# EAGLE design DRM-X_voice(split resistors) (EAGLE 7.4.0)
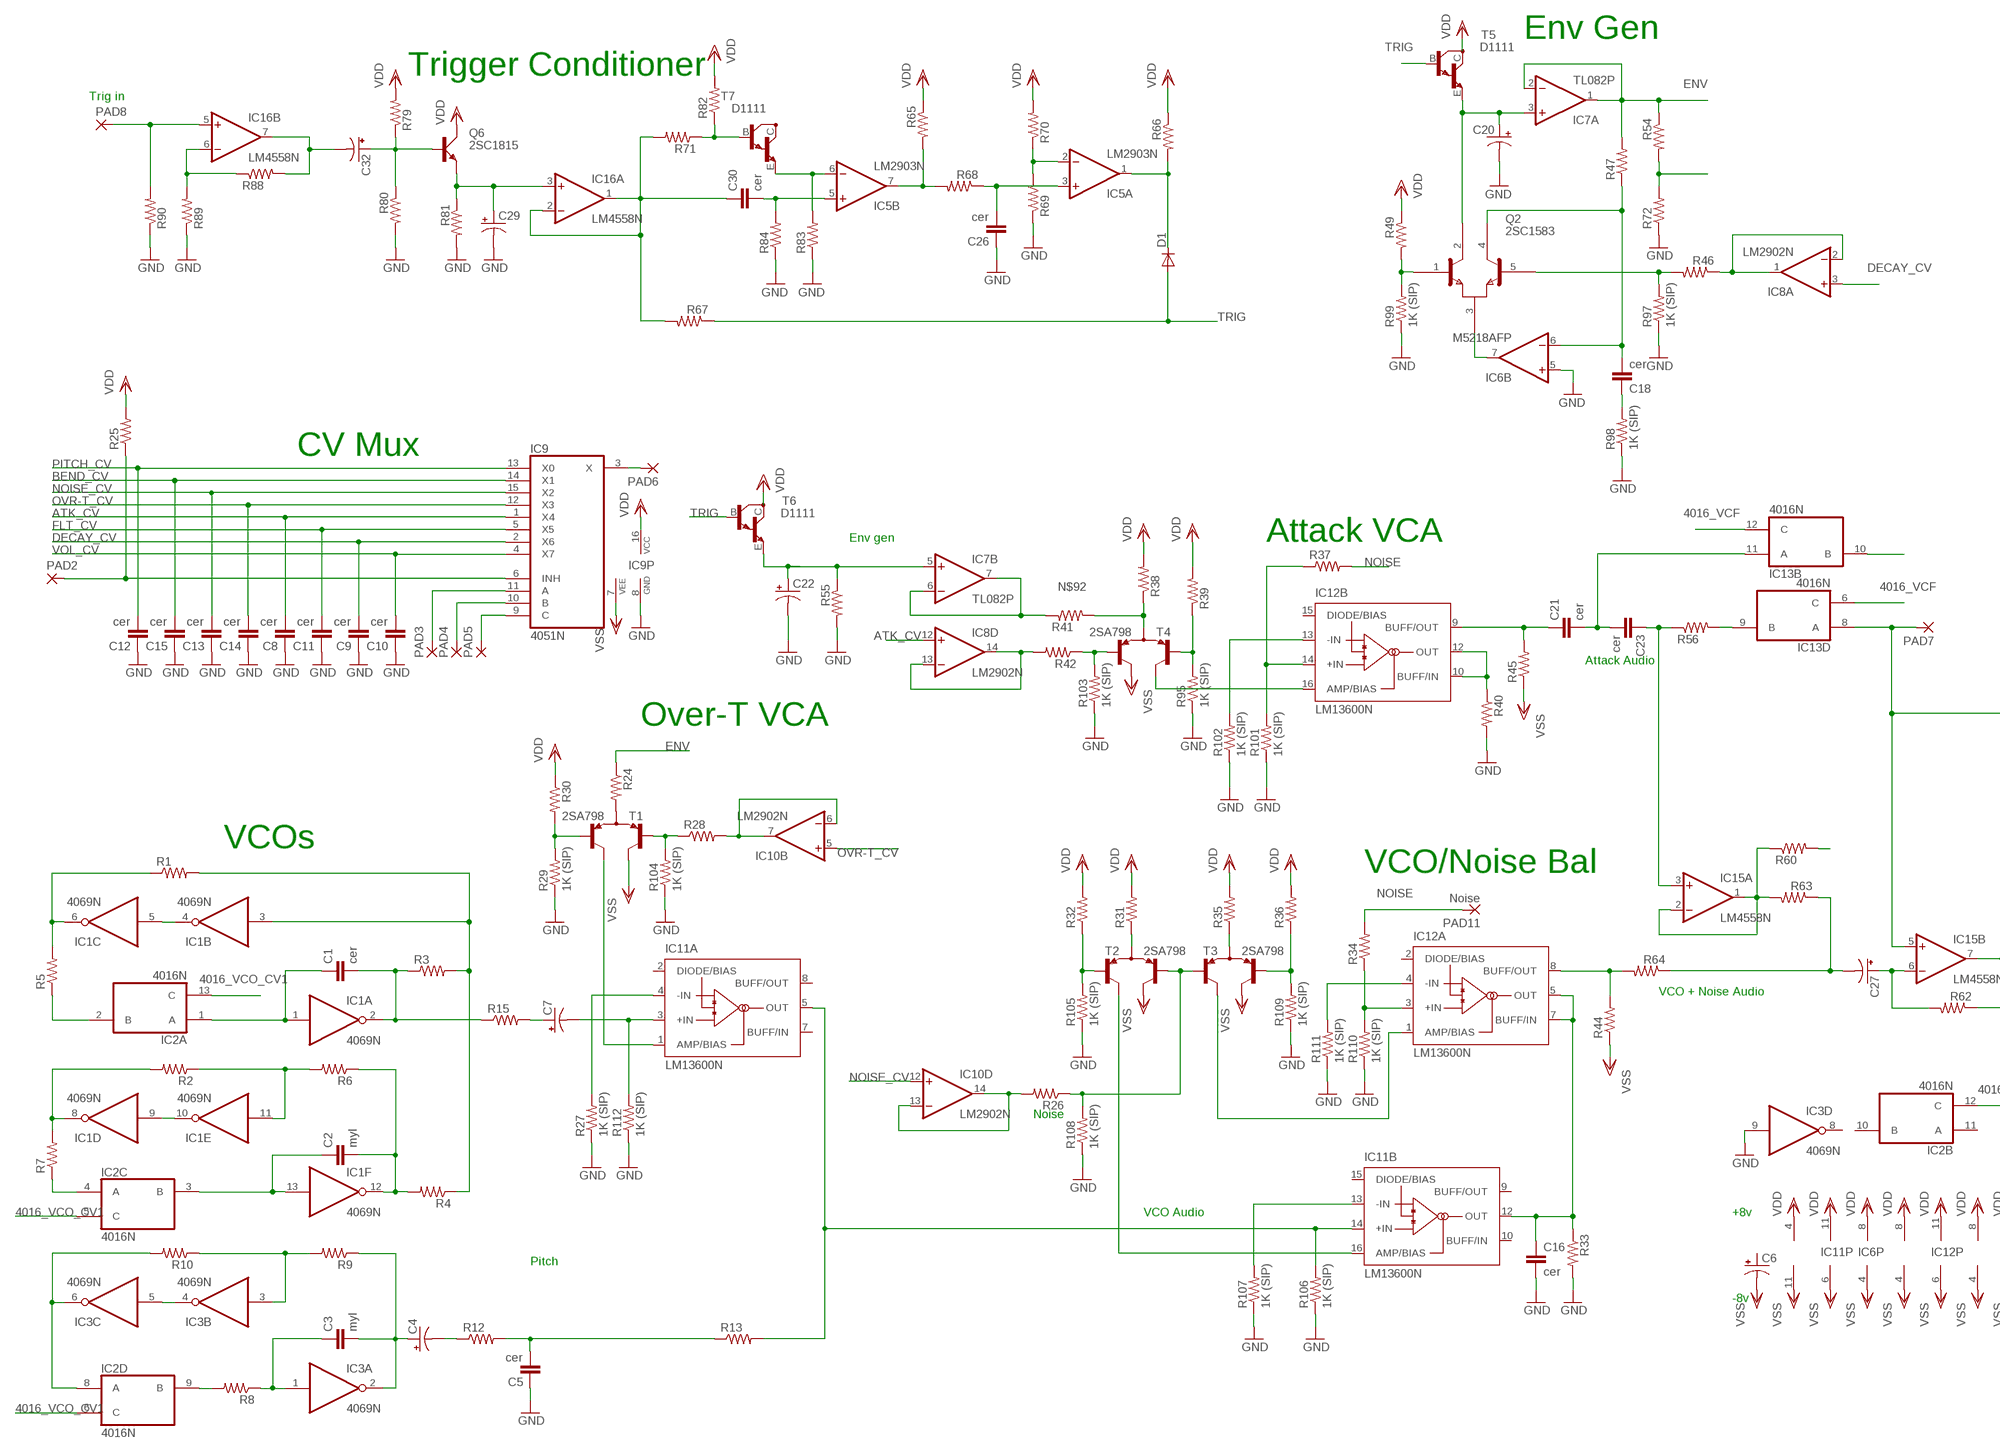
[diagram p0: schematic, sheet 1, part 1 of 2]
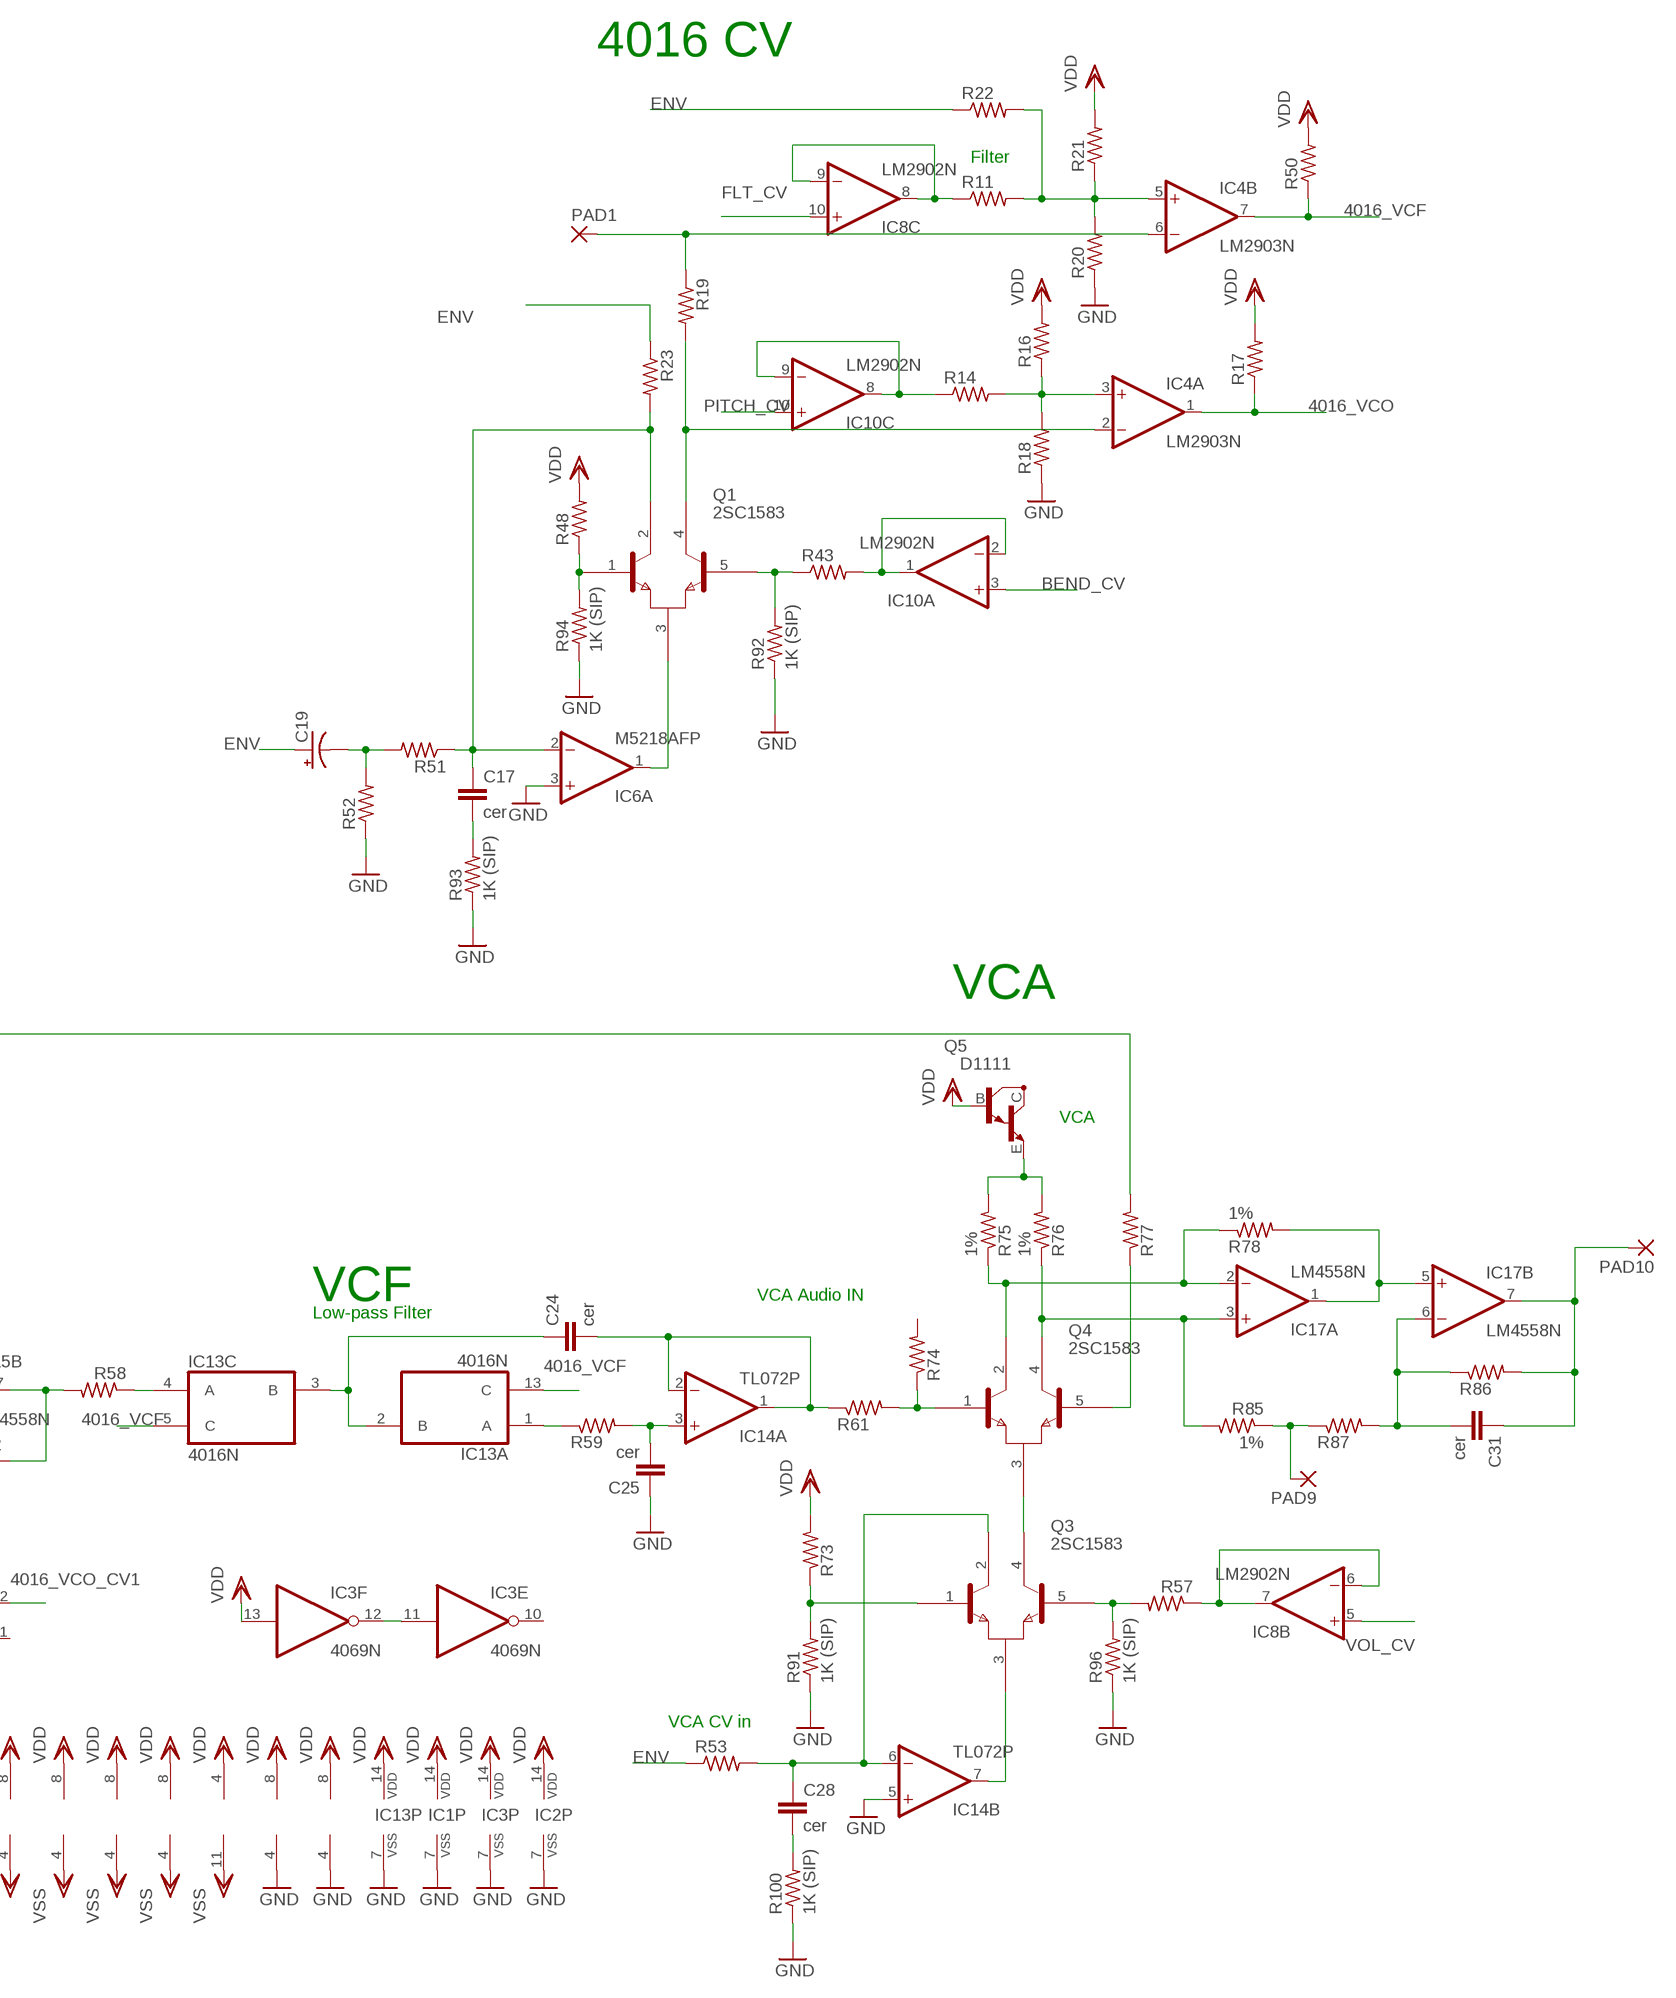
[diagram p1: schematic, sheet 1, part 2 of 2]

## Parts
C1  cer  C-EU025-025X050  [C025-025X050]
C2  myl  C-EU025-024X044  [C025-024X044]
C3  myl  C-EU025-024X044  [C025-024X044]
C4  CPOL-USE2.5-5  [E2,5-5]
C5  cer  C-EU025-025X050  [C025-025X050]
C6  CPOL-USE2.5-7  [E2,5-7]
C7  CPOL-USE2.5-5  [E2,5-5]
C8  cer  C-EU025-025X050  [C025-025X050]
C9  cer  C-EU025-025X050  [C025-025X050]
C10  cer  C-EU025-025X050  [C025-025X050]
C11  cer  C-EU025-025X050  [C025-025X050]
C12  cer  C-EU025-025X050  [C025-025X050]
C13  cer  C-EU025-025X050  [C025-025X050]
C14  cer  C-EU025-025X050  [C025-025X050]
C15  cer  C-EU025-025X050  [C025-025X050]
C16  cer  C-EU025-025X050  [C025-025X050]
C17  cer  C-EU025-025X050  [C025-025X050]
C18  cer  C-EU025-025X050  [C025-025X050]
C19  CPOL-USE2.5-5  [E2,5-5]
C20  CPOL-USE2.5-5  [E2,5-5]
C21  cer  C-EU025-025X050  [C025-025X050]
C22  CPOL-USE2.5-5  [E2,5-5]
C23  cer  C-EU025-025X050  [C025-025X050]
C24  cer  C-EU025-025X050  [C025-025X050]
C25  cer  C-EU025-025X050  [C025-025X050]
C26  cer  C-EU025-025X050  [C025-025X050]
C27  CPOL-USE2.5-5  [E2,5-5]
C28  cer  C-EU025-025X050  [C025-025X050]
C29  CPOL-USE2.5-5  [E2,5-5]
C30  cer  C-EU025-025X050  [C025-025X050]
C31  cer  C-EU025-025X050  [C025-025X050]
C32  CPOL-USE2.5-5  [E2,5-5]
D1  DIODE-D-5  [D-5]
IC1  4069N  [DIL14]
IC2  4016N  [DIL14]
IC3  4069N  [DIL14]
IC4  LM2903N  [DIL08]
IC5  LM2903N  [DIL08]
IC6  M5218AFP  [SOP8]
IC7  TL082P  [DIL08]
IC8  LM2902N  [DIL14]
IC9  4051N  [DIL16]
IC10  LM2902N  [DIL14]
IC11  LM13600N  [DIL16]
IC12  LM13600N  [DIL16]
IC13  4016N  [DIL14]
IC14  TL072P  [DIL08]
IC15  LM4558N  [DIL08]
IC16  LM4558N  [DIL08]
IC17  LM4558N  [DIL08]
PAD1  2,0/0,9-O  [2,0/0,9-O]
PAD2  2,0/0,9-O  [2,0/0,9-O]
PAD3  2,0/0,9-O  [2,0/0,9-O]
PAD4  2,0/0,9-O  [2,0/0,9-O]
PAD5  2,0/0,9-O  [2,0/0,9-O]
PAD6  2,0/0,9-O  [2,0/0,9-O]
PAD7  2,0/0,9-O  [2,0/0,9-O]
PAD8  2,0/0,9-O  [2,0/0,9-O]
PAD9  2,0/0,9-O  [2,0/0,9-O]
PAD10  2,0/0,9-O  [2,0/0,9-O]
PAD11  Noise  2,0/0,9-O  [2,0/0,9-O]
Q1  2SC1583  [XSIST_SIP5]
Q2  2SC1583  [XSIST_SIP5]
Q3  2SC1583  [XSIST_SIP5]
Q4  2SC1583  [XSIST_SIP5]
Q5  D1111  BC517D1111-ECB  [TO92-ECB]
Q6  2SC1815  [TO92-LINE]
R1  R-US_0204/7  [0204/7]
R2  R-US_0204/7  [0204/7]
R3  R-US_0204/7  [0204/7]
R4  R-US_0204/7  [0204/7]
R5  R-US_0204/7  [0204/7]
R6  R-US_0204/7  [0204/7]
R7  R-US_0204/7  [0204/7]
R8  R-US_0204/7  [0204/7]
R9  R-US_0204/7  [0204/7]
R10  R-US_0204/7  [0204/7]
R11  R-US_0204/7  [0204/7]
R12  R-US_0204/7  [0204/7]
R13  R-US_0204/7  [0204/7]
R14  R-US_0204/7  [0204/7]
R15  R-US_0204/7  [0204/7]
R16  R-US_0204/7  [0204/7]
R17  R-US_0204/7  [0204/7]
R18  R-US_0204/7  [0204/7]
R19  R-US_0204/7  [0204/7]
R20  R-US_0204/7  [0204/7]
R21  R-US_0204/7  [0204/7]
R22  R-US_0204/7  [0204/7]
R23  R-US_0204/7  [0204/7]
R24  R-US_0204/7  [0204/7]
R25  R-US_0204/7  [0204/7]
R26  R-US_0204/7  [0204/7]
R27  1K (SIP)  R-US_0204/7  [0204/7]
R28  R-US_0204/7  [0204/7]
R29  1K (SIP)  R-US_0204/7  [0204/7]
R30  R-US_0204/7  [0204/7]
R31  R-US_0204/7  [0204/7]
R32  R-US_0204/7  [0204/7]
R33  R-US_0204/7  [0204/7]
R34  R-US_0204/7  [0204/7]
R35  R-US_0204/7  [0204/7]
R36  R-US_0204/7  [0204/7]
R37  R-US_0204/7  [0204/7]
R38  R-US_0204/7  [0204/7]
R39  R-US_0204/7  [0204/7]
R40  R-US_0204/7  [0204/7]
R41  R-US_0204/7  [0204/7]
R42  R-US_0204/7  [0204/7]
R43  R-US_0204/7  [0204/7]
R44  R-US_0204/7  [0204/7]
R45  R-US_0204/7  [0204/7]
R46  R-US_0204/7  [0204/7]
R47  R-US_0204/7  [0204/7]
R48  R-US_0204/7  [0204/7]
R49  R-US_0204/7  [0204/7]
R50  R-US_0204/7  [0204/7]
R51  R-US_0204/7  [0204/7]
R52  R-US_0204/7  [0204/7]
R53  R-US_0204/7  [0204/7]
R54  R-US_0204/7  [0204/7]
R55  R-US_0204/7  [0204/7]
R56  R-US_0204/7  [0204/7]
R57  R-US_0204/7  [0204/7]
R58  R-US_0204/7  [0204/7]
R59  R-US_0204/7  [0204/7]
R60  R-US_0204/7  [0204/7]
R61  R-US_0204/7  [0204/7]
R62  R-US_0204/7  [0204/7]
R63  R-US_0204/7  [0204/7]
R64  R-US_0204/7  [0204/7]
R65  R-US_0204/7  [0204/7]
R66  R-US_0204/7  [0204/7]
R67  R-US_0204/7  [0204/7]
R68  R-US_0204/7  [0204/7]
R69  R-US_0204/7  [0204/7]
R70  R-US_0204/7  [0204/7]
R71  R-US_0204/7  [0204/7]
R72  R-US_0204/7  [0204/7]
R73  R-US_0204/7  [0204/7]
R74  R-US_0204/7  [0204/7]
R75  1%  R-US_0204/7  [0204/7]
R76  1%  R-US_0204/7  [0204/7]
R77  R-US_0204/7  [0204/7]
R78  1%  R-US_0204/7  [0204/7]
R79  R-US_0204/7  [0204/7]
R80  R-US_0204/7  [0204/7]
R81  R-US_0204/7  [0204/7]
R82  R-US_0204/7  [0204/7]
R83  R-US_0204/7  [0204/7]
R84  R-US_0204/7  [0204/7]
R85  1%  R-US_0204/7  [0204/7]
R86  R-US_0204/7  [0204/7]
R87  R-US_0204/7  [0204/7]
R88  R-US_0204/7  [0204/7]
R89  R-US_0204/7  [0204/7]
R90  R-US_0204/7  [0204/7]
R91  1K (SIP)  R-US_0204/7  [0204/7]
R92  1K (SIP)  R-US_0204/7  [0204/7]
R93  1K (SIP)  R-US_0204/7  [0204/7]
R94  1K (SIP)  R-US_0204/7  [0204/7]
R95  1K (SIP)  R-US_0204/7  [0204/7]
R96  1K (SIP)  R-US_0204/7  [0204/7]
R97  1K (SIP)  R-US_0204/7  [0204/7]
R98  1K (SIP)  R-US_0204/7  [0204/7]
R99  1K (SIP)  R-US_0204/7  [0204/7]
R100  1K (SIP)  R-US_0204/7  [0204/7]
R101  1K (SIP)  R-US_0204/7  [0204/7]
R102  1K (SIP)  R-US_0204/7  [0204/7]
R103  1K (SIP)  R-US_0204/7  [0204/7]
R104  1K (SIP)  R-US_0204/7  [0204/7]
R105  1K (SIP)  R-US_0204/7  [0204/7]
R106  1K (SIP)  R-US_0204/7  [0204/7]
R107  1K (SIP)  R-US_0204/7  [0204/7]
R108  1K (SIP)  R-US_0204/7  [0204/7]
R109  1K (SIP)  R-US_0204/7  [0204/7]
R110  1K (SIP)  R-US_0204/7  [0204/7]
R111  1K (SIP)  R-US_0204/7  [0204/7]
R112  1K (SIP)  R-US_0204/7  [0204/7]
T1  2SA798  [SIP-5]
T2  2SA798  [SIP-5]
T3  2SA798  [SIP-5]
T4  2SA798  [SIP-5]
T5  D1111  BC517D1111-ECB  [TO92-ECB]
T6  D1111  BC517D1111-ECB  [TO92-ECB]
T7  D1111  BC517D1111-ECB  [TO92-ECB]

## Nets
4016_VCF: IC4.7(B:OUT) IC13.5(C:C) IC13.6(D:C) IC13.12(B:C) IC13.13(A:C) R50.1
4016_VCO: IC4.1(A:OUT) R17.1
4016_VCO_CV1: IC2.5(C:C) IC2.6(D:C) IC2.12(B:C) IC2.13(A:C)
ATK_CV: C8.2 IC8.12(D:+IN) IC9.1(X4)
BEND_CV: C15.2 IC9.14(X1) IC10.3(A:+IN)
DECAY_CV: C9.2 IC8.3(A:+IN) IC9.2(X6)
ENV: C19.+ IC7.1(A:OUT) IC7.2(A:-IN) R22.1 R23.1 R24.1 R47.2 R53.1 R54.1
FLT_CV: C11.2 IC8.10(C:+IN) IC9.5(X5)
GND: C5.1 C8.1 C9.1 C10.1 C11.1 C12.1 C13.1 C14.1 C15.1 C16.2 C20.- C22.- C25.1 C26.1 C29.- IC1.7(P:VSS) IC2.7(P:VSS) IC3.7(P:VSS) IC3.9(D:I) IC4.4(P:V-) IC5.4(P:V-) IC6.3(A:+IN) IC6.5(B:+IN) IC9.8(GND) IC13.7(P:VSS) IC14.5(B:+IN) R18.1 R20.1 R27.1 R29.1 R33.2 R40.2 R52.1 R55.2 R69.1 R72.1 R80.2 R81.2 R83.1 R84.1 R89.1 R90.1 R91.1 R92.1 R93.1 R94.1 R95.1 R96.1 R97.1 R98.1 R99.1 R100.1 R101.1 R102.1 R103.1 R104.1 R105.1 R106.1 R107.1 R108.1 R109.1 R110.1 R111.1 R112.1
N$1: IC1.4(B:O) IC1.5(C:I)
N$2: IC1.6(C:O) R1.1 R5.2
N$3: C1.1 IC1.1(A:I) IC2.1(A:A)
N$4: C1.2 IC1.2(A:O) R3.1 R15.1
N$5: IC1.8(D:O) R2.2 R7.2
N$6: IC1.11(E:I) R2.1 R6.2
N$7: IC1.3(B:I) R1.2 R3.2 R4.1
N$8: IC2.4(C:A) R7.1
N$9: IC1.9(D:I) IC1.10(E:O)
N$10: C2.1 IC1.13(F:I) IC2.3(C:B)
N$11: C2.2 IC1.12(F:O) R4.2 R6.1
N$12: C3.2 C4.+ IC3.2(A:O) R9.1
N$13: C3.1 IC3.1(A:I) R8.1
N$14: C28.1 IC14.6(B:-IN) Q3.2(C1) R53.2
N$15: IC3.3(B:I) R9.2 R10.1
N$16: IC2.2(A:B) R5.1
N$17: IC2.8(D:A) IC3.6(C:O) R10.2
N$18: IC3.4(B:O) IC3.5(C:I)
N$19: IC2.9(D:B) R8.2
N$20: C4.- R12.1
N$21: IC3.11(E:I) IC3.12(F:O)
N$22: C5.2 R12.2 R13.1
N$23: IC10.8(C:OUT) IC10.9(C:-IN) R14.1
N$24: IC10.6(B:-IN) IC10.7(B:OUT) R28.2
N$25: IC10.1(A:OUT) IC10.2(A:-IN) R43.2
N$26: IC10.13(D:-IN) IC10.14(D:OUT) R26.2
N$27: C21.1 IC12.9(B:BUFF/OUT) R45.2
N$28: IC4.3(A:+IN) R14.2 R16.1 R18.2
N$29: IC8.1(A:OUT) IC8.2(A:-IN) R46.1
N$30: IC8.13(D:-IN) IC8.14(D:OUT) R42.2
N$31: IC8.8(C:OUT) IC8.9(C:-IN) R11.1
N$32: IC8.6(B:-IN) IC8.7(B:OUT) R57.1
N$33: IC4.5(B:+IN) R11.2 R20.2 R21.1 R22.2
N$34: C17.1 IC6.2(A:-IN) Q1.2(C1) R23.2 R51.1
N$35: IC13.4(C:A) R58.1
N$36: IC4.6(B:-IN) PAD1.1(P) R19.1
N$37: IC4.2(A:-IN) Q1.4(C2) R19.2
N$38: C7.+ R15.2
N$40: C7.- IC11.3(A:+IN) R112.2
N$42: R24.2 T1.3(E)
N$43: R28.1 R104.2 T1.1(B1)
N$44: R29.2 R30.2 T1.5(B2)
N$45: IC6.1(A:OUT) Q1.3(E)
N$46: IC11.1(A:AMP/BIAS) T1.4(C2)
N$47: C16.1 IC11.12(B:OUT) IC12.5(A:OUT) IC12.7(A:BUFF/IN) R33.1
N$48: IC11.4(A:-IN) R27.2
N$49: IC9.6(INH) PAD2.1(P) R25.1
N$50: IC9.9(C) PAD5.1(P)
N$51: IC9.10(B) PAD4.1(P)
N$52: IC9.11(A) PAD3.1(P)
N$53: IC9.3(X) PAD6.1(P)
N$54: IC11.13(B:-IN) R107.2
N$56: R32.1 R105.2 T2.1(B1)
N$57: R26.1 R108.2 T2.5(B2) T3.1(B1)
N$58: R31.1 T2.3(E)
N$59: IC11.16(B:AMP/BIAS) T2.2(C1)
N$60: IC12.3(A:+IN) R34.1 R110.2
N$61: IC12.1(A:AMP/BIAS) T3.2(C1)
N$62: R36.1 R109.2 T3.5(B2)
N$63: R35.1 T3.3(E)
N$64: R39.1 R95.2 T4.1(B1)
N$65: IC12.8(A:BUFF/OUT) R44.2 R64.2
N$67: IC12.4(A:-IN) R111.2
N$68: IC13.9(D:B) R56.2
N$69: R38.1 R41.2 T4.3(E)
N$70: IC12.16(B:AMP/BIAS) T4.2(C1)
N$71: IC12.14(B:+IN) R37.1 R101.2
N$72: IC12.13(B:-IN) R102.2
N$73: R42.1 R103.2 T4.5(B2)
N$74: IC12.10(B:BUFF/IN) IC12.12(B:OUT) R40.1
N$75: Q1.5(B2) R43.1 R92.2
N$76: C17.2 R93.2
N$77: Q2.5(B2) R46.2 R97.2
N$78: Q1.1(B1) R48.1 R94.2
N$79: C18.2 IC6.6(B:-IN) Q2.4(C2) R47.1
N$80: C18.1 R98.2
N$81: Q2.1(B1) R49.2 R99.2
N$82: IC6.7(B:OUT) Q2.3(E)
N$83: C24.1 IC13.2(A:B) IC13.3(C:B)
N$84: Q3.1(B1) R73.1 R91.2
N$85: C21.2 C23.2 IC13.11(B:A)
N$86: C19.- R51.2 R52.2
N$87: C20.+ IC7.3(A:+IN) Q2.2(C1) T5.E
N$92: IC7.6(B:-IN) IC7.7(B:OUT) R41.1
N$93: C23.1 IC15.3(A:+IN) R56.1
N$94: C22.+ IC7.5(B:+IN) R55.1 T6.E
N$95: IC13.1(A:A) R59.1
N$96: C25.2 IC14.3(A:+IN) R59.2
N$97: C24.2 IC14.1(A:OUT) IC14.2(A:-IN) R61.1
N$98: IC15.1(A:OUT) IC15.2(A:-IN) R60.1 R63.2
N$99: IC15.7(B:OUT) R58.2 R62.1
N$100: C27.+ IC15.6(B:-IN) R62.2
N$101: D1.C IC5.1(A:OUT) R66.2
N$102: IC13.8(D:A) IC15.5(B:+IN) PAD7.1(P) R77.2
N$103: IC5.7(B:OUT) R65.2 R68.2
N$104: IC5.2(A:-IN) R69.2 R70.1
N$105: PAD9.1(P) R85.1 R87.1
N$106: R54.2 R72.2
N$107: C26.2 IC5.3(A:+IN) R68.1
N$108: C27.- R63.1 R64.1
N$109: IC13.10(B:B)
N$110: C28.2 R100.2
N$111: Q3.4(C2) Q4.3(E)
N$113: Q4.1(B1) R61.2 R74.1
N$114: C29.+ IC16.3(A:+IN) Q6.3(E) R81.1
N$115: IC17.3(A:+IN) Q4.4(C2) R76.1 R85.2
N$116: Q4.5(B2) R77.1
N$117: IC17.2(A:-IN) Q4.2(C1) R75.1 R78.1
N$118: Q5.E R75.2 R76.2
N$119: IC17.1(A:OUT) IC17.5(B:+IN) R78.2
N$120: C32.+ Q6.1(B) R79.1 R80.1
N$121: IC16.6(B:-IN) R88.1 R89.2
N$122: C30.1 IC16.1(A:OUT) IC16.2(A:-IN) R67.2 R71.2
N$123: R71.1 R82.1 T7.B
N$124: IC5.6(B:-IN) R83.2 T7.E
N$125: C30.2 IC5.5(B:+IN) R84.2
N$126: C32.- IC16.7(B:OUT) R88.2
N$127: IC14.7(B:OUT) Q3.3(E)
N$128: Q3.5(B2) R57.2 R96.2
N$129: R60.2
N$130: IC16.5(B:+IN) PAD8.1(P) R90.2
N$134: C31.2 IC17.6(B:-IN) R86.1 R87.2
N$136: C31.1 IC17.7(B:OUT) PAD10.1(P) R86.2
NOISE: PAD11.1(P) R34.2 R37.2
NOISE_CV: C13.2 IC9.15(X2) IC10.12(D:+IN)
OVR-T_CV: C14.2 IC9.12(X3) IC10.5(B:+IN)
PITCH_CV: C12.2 IC9.13(X0) IC10.10(C:+IN)
TRIG: D1.A R67.1 T5.B T6.B
VCO_OUT: IC11.5(A:OUT) IC11.14(B:+IN) R13.2 R106.2
VDD: IC1.14(P:VDD) IC2.14(P:VDD) IC3.13(F:I) IC3.14(P:VDD) IC4.8(P:V+) IC5.8(P:V+) IC6.8(P:V+) IC7.8(P:V+) IC8.4(P:V+) IC9.16(VCC) IC10.4(P:V+) IC11.11(P:V+) IC12.11(P:V+) IC13.14(P:VDD) IC14.8(P:V+) IC15.8(P:V+) IC16.8(P:V+) IC17.8(P:V+) Q5.B Q6.2(C) R16.2 R17.2 R21.2 R25.2 R30.1 R31.2 R32.2 R35.2 R36.2 R38.2 R39.2 R48.2 R49.1 R50.2 R65.1 R66.1 R70.2 R73.2 R79.2 R82.2 T5.C T6.C
VOL_CV: C10.2 IC8.5(B:+IN) IC9.4(X7)
VSS: C6.- IC6.4(P:V-) IC7.4(P:V-) IC8.11(P:V-) IC9.7(VEE) IC10.11(P:V-) IC11.6(P:V-) IC12.6(P:V-) IC14.4(P:V-) IC15.4(P:V-) IC16.4(P:V-) IC17.4(P:V-) R44.1 R45.1 T1.2(C1) T2.4(C2) T3.4(C2) T4.4(C2)
Unconnected: C6.+ IC2.10(B:B) IC2.11(B:A) IC3.8(D:O) IC3.10(E:O) IC11.2(A:DIODE/BIAS) IC11.7(A:BUFF/IN) IC11.8(A:BUFF/OUT) IC11.9(B:BUFF/OUT) IC11.10(B:BUFF/IN) IC11.15(B:DIODE/BIAS) IC12.2(A:DIODE/BIAS) IC12.15(B:DIODE/BIAS) Q5.C R74.2 T7.C

## Notes on the sheet
- Env Gen | 4016 CV
- Trigger Conditioner
- Trig in
- Filter
- CV Mux
- Env gen | Attack VCA
- Attack Audio
- VCA
- Over-T VCA
- VCA
- VCOs
- VCO/Noise Bal
- VCF | VCA Audio IN
- Low-pass Filter
- VCO + Noise Audio
- Noise
- VCA CV in
- VCO Audio | +8v
- Pitch
- -8v

## Library data of the parts
C1-C3 C5 C8-C18 C21 C23-C26 C28 C30 C31 = rcl:C-EU: CAPACITOR, European symbol
C4 C6 C7 C19 C20 C22 C27 C29 C32 = rcl:CPOL-US: POLARIZED CAPACITOR, American symbol
D1 = diode:DIODE-: DIODE
IC1 IC3 = 40xx:4069: Hex INVERTER
IC2 IC13 = 40xx:4016: Quad bilateral ANALOG SWITCH
IC4 IC5 = linear:LM2903: COMPARATOR
IC6 = mitsubishi-semiconductor:M5218: DUAL LOW-NOISE OPERATIONAL AMPLIFIER (DUAL POWER SUPPLY TYPE) Source: Mitsubishi M5218AL/P/FP
IC7 = linear:TL082: OP AMP Data sheet <http://www.ti.com/lit/ds/symlink/tl084a . pdf>; DATA_SHEET: <a href="http://www.ti.com/lit/ds/symlink/tl084a.pdf"> Data sheet </a>
IC8 IC10 = linear:LM2902: Low power quad operational amplifier Source: Data sgeet <http://www.st.com/internet/com/TECHNICAL_RESOURCES/TECHNICAL_LITERATURE/DATASHEET/CD00000533.pdf>
IC9 = 40xx:4051: 8-channel ANALOG MULTIPLEXER
IC11 IC12 = national-semiconductor:LM13600: Dual Operational Transconductance Amplifiers with Linearizing Diodes and Buffers Source: lm13600.PDF
IC14 = linear:TL072: OP AMP
IC15-IC17 = linear:*4558: OP AMP
PAD1-PAD11 = synthdiy:2,0/0,9-O: OCT THROUGH-HOLE PAD 2.0 mm, 0.9 mm/0.079",0.035"
Q1-Q4 = synthdiy:2SC1583: Dual low noise NPN TRANSISTOR.
Q5 T5-T7 = transistor:BC517: NPN BIPOLAR DARLINGTON TRANSISTOR
Q6 = akihabara:2SC1815: 2SC1815 Audio frequency general purpose amplifier. Package ECB. Complementary to 2SA1015
R1-R112 = rcl:R-US_: RESISTOR, American symbol
T1-T4 = transistor:2SA798: PNP DIFFERENTAL AMP SIP-5 Source: 2SA798.pdf

## Net classes
1 PWR: width 0.508 mm

## Board
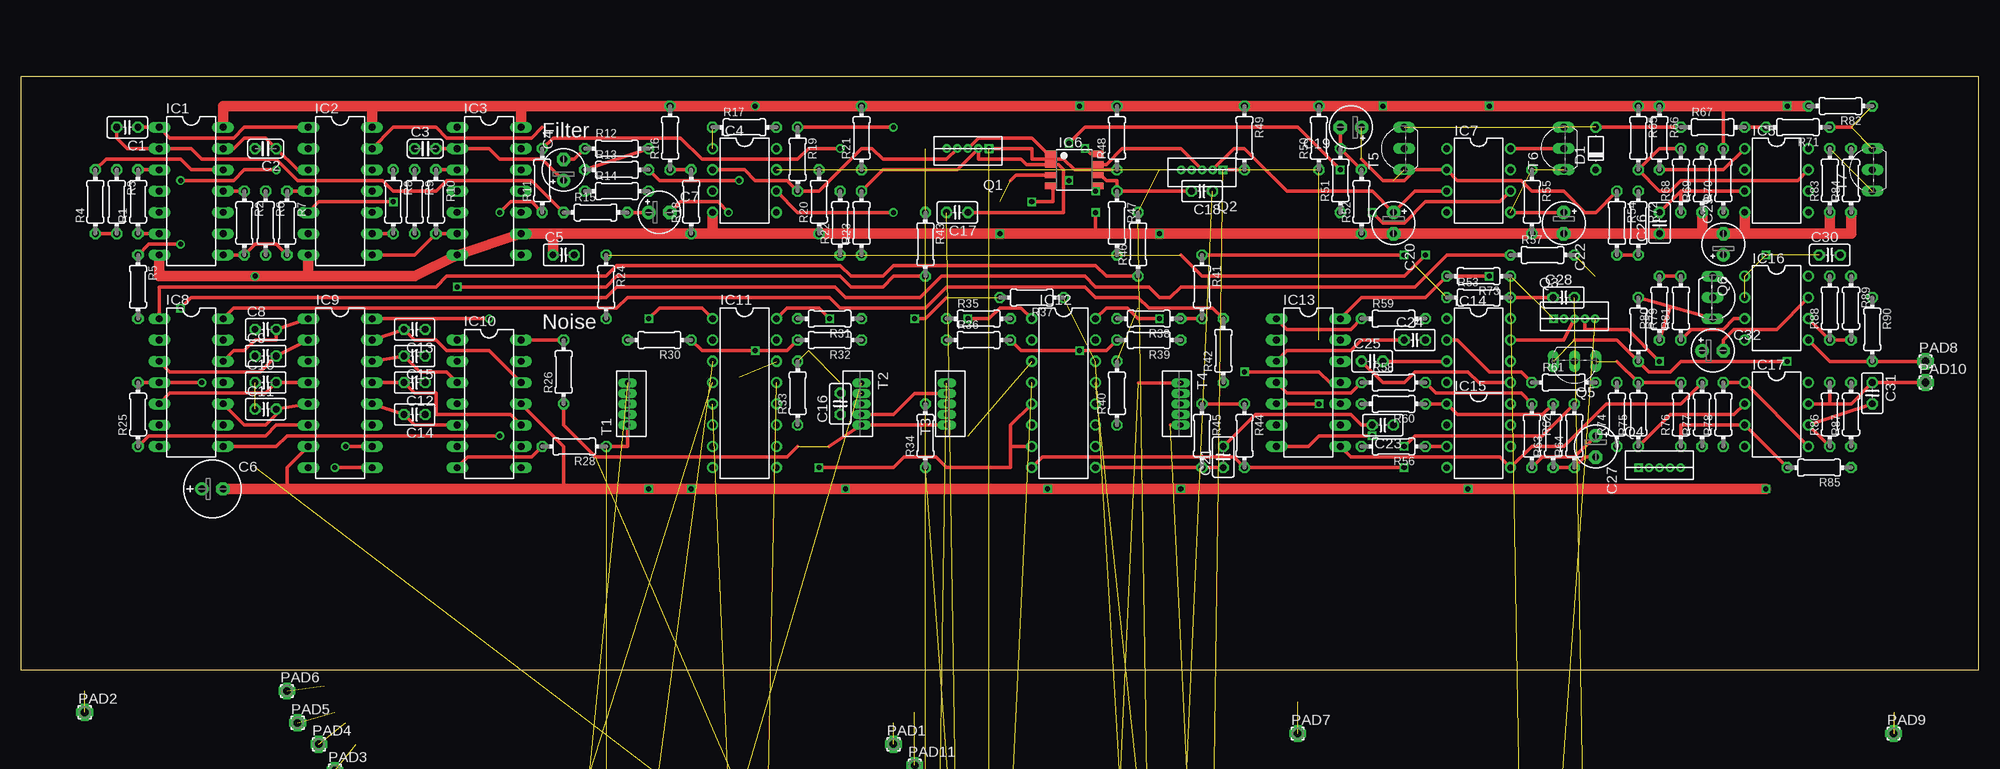
[diagram p2: board, top side]
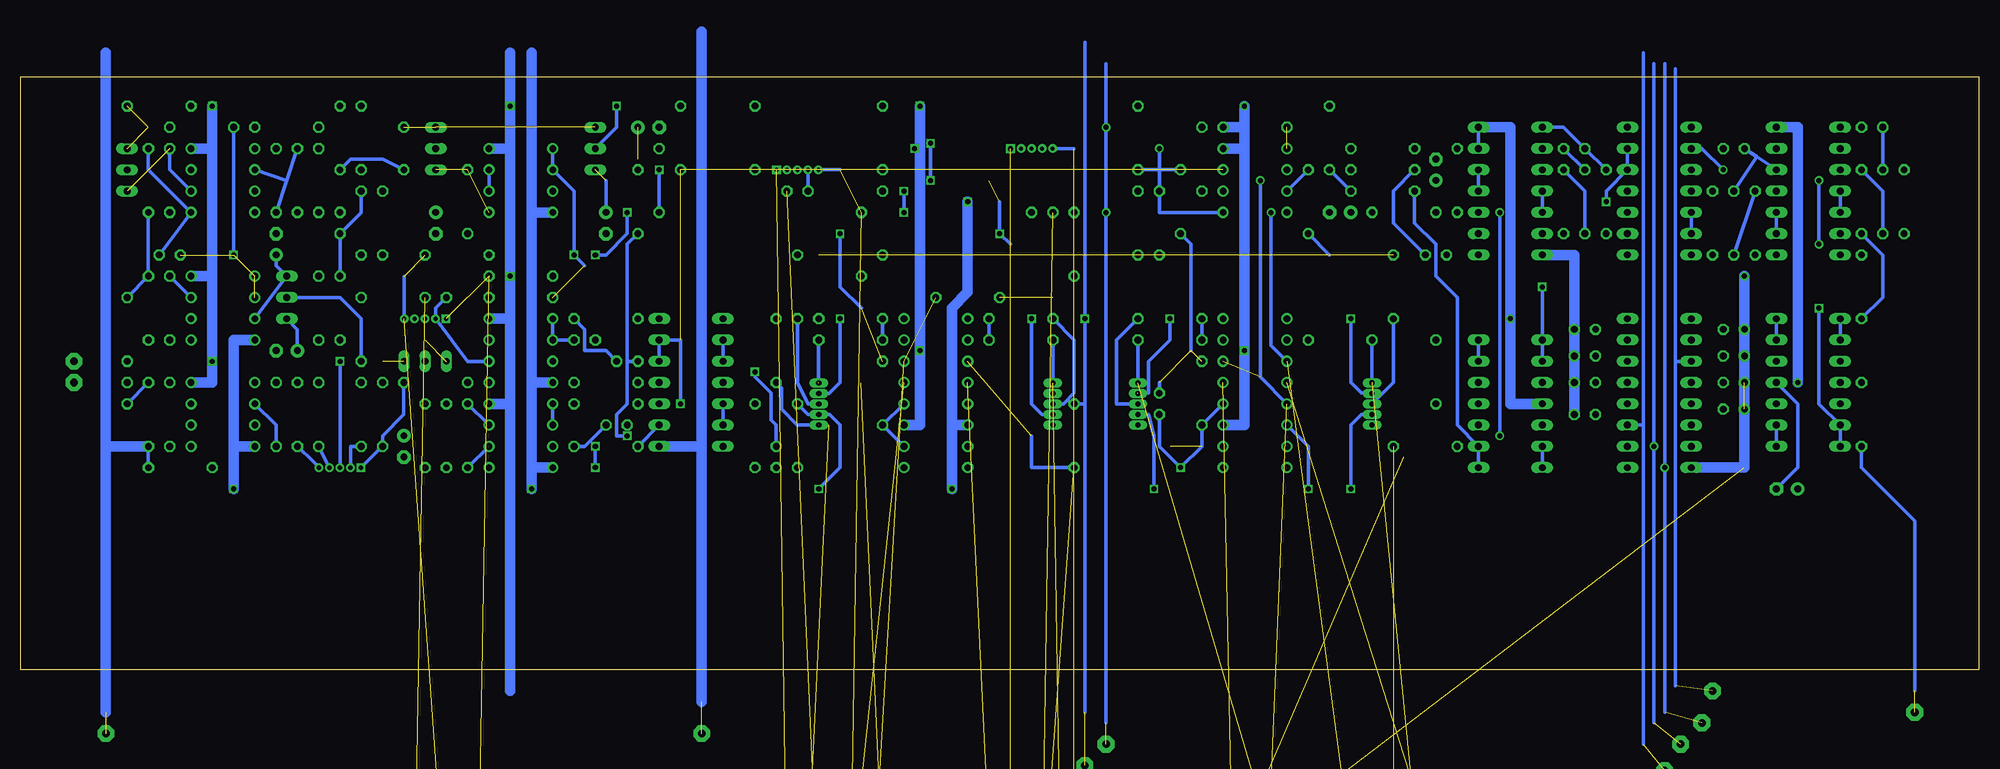
[diagram p3: board, bottom side, seen from below]

Size 233.66 x 70.79 mm. Coordinates in mm from the lower left corner, seen from the top.
Outline: 0,0 233.66,0 233.66,70.79 0,70.79 0,0
Copper layers (1*16): Top 0.035mm / dielectric 1.5mm / Bottom 0.035mm
Design rules "default": minimum track width 10mil, minimum drill 24mil, track to track 8mil, track to pad 8mil, pad to pad 8mil, via to via 8mil, smd to smd 8mil, copper to edge 40mil, drill to drill 8mil, minimum pad ring 10mil, minimum via ring 8mil, stop-mask expansion 4mil, vias tented up to drill 0mil, thermal gap 10mil

### Footprints (pad centres in the part's own frame; a part is rotated, then mirrored left to right if it is on the bottom)
C025-025X050 = drill 0.813 octagon: 1 -1.27,0; 2 1.27,0
C025-024X044 = drill 0.813 octagon: 1 -1.27,0; 2 1.27,0
E2,5-5 = drill 0.813 pad 1.6: + -1.27,0 | drill 0.813 pad 1.6 octagon: - 1.27,0
E2,5-7 = drill 0.813 pad 1.6: + -1.27,0 | drill 0.813 pad 1.6 octagon: - 1.27,0
D-5 = drill 0.813 octagon: A 2.54,0; C -2.54,0
DIL14 = drill 0.813 long: 1 -7.62,-3.81; 2 -5.08,-3.81; 3 -2.54,-3.81; 4 0,-3.81; 5 2.54,-3.81; 6 5.08,-3.81; 7 7.62,-3.81; 8 7.62,3.81; 9 5.08,3.81; 10 2.54,3.81; 11 0,3.81; 12 -2.54,3.81; 13 -5.08,3.81; 14 -7.62,3.81
DIL08 = drill 0.813 pad 1.27: 1 -3.81,-3.81; 2 -1.27,-3.81; 3 1.27,-3.81; 4 3.81,-3.81; 5 3.81,3.81; 6 1.27,3.81; 7 -1.27,3.81; 8 -3.81,3.81
SOP8 = smd 0.76 x 1.27: 1 -1.905,-2.86; 2 -0.635,-2.86; 3 0.635,-2.86; 4 1.905,-2.86; 5 1.905,2.86; 6 0.635,2.86; 7 -0.635,2.86; 8 -1.905,2.86
DIL16 = drill 0.813 long: 1 -8.89,-3.81; 2 -6.35,-3.81; 3 -3.81,-3.81; 4 -1.27,-3.81; 5 1.27,-3.81; 6 3.81,-3.81; 7 6.35,-3.81; 8 8.89,-3.81; 9 8.89,3.81; 10 6.35,3.81; 11 3.81,3.81; 12 1.27,3.81; 13 -1.27,3.81; 14 -3.81,3.81; 15 -6.35,3.81; 16 -8.89,3.81
DIL16' = drill 0.813 pad 1.27: 1 -8.89,-3.81; 2 -6.35,-3.81; 3 -3.81,-3.81; 4 -1.27,-3.81; 5 1.27,-3.81; 6 3.81,-3.81; 7 6.35,-3.81; 8 8.89,-3.81; 9 8.89,3.81; 10 6.35,3.81; 11 3.81,3.81; 12 1.27,3.81; 13 -1.27,3.81; 14 -3.81,3.81; 15 -6.35,3.81; 16 -8.89,3.81
2,0/0,9-O = drill 0.914 pad 2 octagon: 1 0,0
XSIST_SIP5 = drill 0.508 pad 0.034 square: 1 -2.5,0 | drill 0.508 pad 0.034: 2 -1.25,0; 3 0,0; 4 1.25,0; 5 2.5,0
TO92-ECB = drill 0.813 long: B 2.54,0; C 0,0; E -2.54,0
TO92-LINE = drill 0.813 long: 1 2.54,0; 2 0,0; 3 -2.54,0
0204/7 = drill 0.813 octagon: 1 -3.81,0; 2 3.81,0
SIP-5 = drill 0.6 pad 0.7 long: 1 -2.5,0; 2 -1.25,0; 3 0,0; 4 1.25,0; 5 2.5,0

### Placement (x,y rotation side)
C1  12.7,64.77 180 top
C2  29.21,62.23 180 top
C3  48.26,62.23 0 top
C4  64.77,59.69 90 top
C5  64.77,49.53 0 top
C6  22.86,21.59 0 top
C7  76.2,54.61 0 top
C8  29.21,40.64 0 top
C9  29.21,37.47 0 top
C10  29.21,34.29 0 top
C11  29.21,31.11 0 top
C12  46.99,34.29 180 top
C13  46.99,40.64 180 top
C14  46.99,30.48 180 top
C15  46.99,37.47 180 top
C16  97.79,31.75 90 top
C17  111.76,54.61 180 top
C18  140.97,57.15 180 top
C19  158.75,64.77 180 top
C20  163.83,53.34 270 top
C21  143.51,25.4 90 top
C22  184.15,53.34 270 top
C23  162.56,29.21 180 top
C24  166.37,39.37 0 top
C25  161.29,36.83 0 top
C26  195.58,53.34 90 top
C27  187.96,26.67 270 top
C28  184.15,44.45 0 top
C29  203.2,50.8 90 top
C30  215.9,49.53 0 top
C31  220.98,33.02 270 top
C32  201.93,38.1 0 top
D1  187.96,62.23 90 top
IC1  20.32,57.15 270 top
IC2  38.1,57.15 270 top
IC3  55.88,57.15 270 top
IC4  86.36,58.42 270 top
IC5  209.55,58.42 270 top
IC6  125.73,59.69 270 top
IC7  173.99,58.42 270 top
IC8  20.32,34.29 270 top
IC9  38.1,33.02 270 top
IC10  55.88,31.75 270 top
IC11  LM13600N  [DIL16']  86.36,33.02 270 top
IC12  LM13600N  [DIL16']  124.46,33.02 270 top
IC13  153.67,34.29 270 top
IC14  173.99,38.1 270 top
IC15  173.99,27.94 270 top
IC16  209.55,43.18 270 top
IC17  209.55,30.48 270 top
PAD1  104.14,-8.89 0 top  (outside the outline)
PAD2  7.62,-5.08 0 top  (outside the outline)
PAD3  37.47,-12.06 0 top  (outside the outline)
PAD4  35.56,-8.89 0 top  (outside the outline)
PAD5  33.02,-6.35 0 top  (outside the outline)
PAD6  31.75,-2.54 0 top
PAD7  152.4,-7.62 0 top  (outside the outline)
PAD8  227.33,36.83 0 top
PAD9  223.52,-7.62 0 top  (outside the outline)
PAD10  227.33,34.29 0 top
PAD11  106.68,-11.43 0 top  (outside the outline)
Q1  113.03,62.23 180 top
Q2  140.97,59.69 180 top
Q3  185.42,41.91 0 top
Q4  195.58,24.13 0 top
Q5  185.42,36.83 180 top
Q6  201.93,44.45 270 top
R1  13.97,55.88 90 top
R2  26.67,53.34 270 top
R3  11.43,55.88 270 top
R4  8.89,55.88 90 top
R5  13.97,45.72 270 top
R6  29.21,53.34 270 top
R7  31.75,53.34 270 top
R8  44.45,55.88 270 top
R9  46.99,55.88 270 top
R10  49.53,55.88 270 top
R11  62.23,58.42 90 top
R12  71.12,62.23 0 top
R13  71.12,59.69 0 top
R14  71.12,57.15 0 top
R15  68.58,54.61 0 top
R16  77.47,63.5 90 top
R17  86.36,64.77 0 top
R18  80.01,55.88 90 top
R19  92.71,60.96 270 top
R20  95.25,55.88 90 top
R21  100.33,63.5 90 top
R22  97.79,53.34 90 top
R23  100.33,53.34 90 top
R24  69.85,45.72 270 top
R25  13.97,30.48 90 top
R26  64.77,35.56 90 top
R27  62.23,-34.29 90 top  (outside the outline)
R28  66.04,26.67 180 top
R29  66.04,-34.29 90 top  (outside the outline)
R30  76.2,39.37 180 top
R31  96.52,41.91 180 top
R32  96.52,39.37 180 top
R33  92.71,33.02 90 top
R34  107.95,27.94 90 top
R35  114.3,41.91 0 top
R36  114.3,39.37 0 top
R37  120.65,44.45 180 top
R38  134.62,41.91 180 top
R39  134.62,39.37 180 top
R40  130.81,33.02 90 top
R41  140.97,45.72 270 top
R42  143.51,38.1 90 top
R43  107.95,50.8 270 top
R44  146.05,27.94 270 top
R45  140.97,27.94 270 top
R46  133.35,50.8 90 top
R47  130.81,53.34 270 top
R48  130.81,63.5 90 top
R49  146.05,63.5 270 top
R50  154.94,63.5 90 top
R51  157.48,58.42 90 top
R52  160.02,55.88 90 top
R53  173.99,44.45 0 top
R54  190.5,53.34 270 top
R55  180.34,55.88 270 top
R56  163.83,26.67 180 top
R57  181.61,49.53 0 top
R58  163.83,34.29 0 top
R59  163.83,41.91 0 top
R60  163.83,31.75 180 top
R61  184.15,34.29 0 top
R62  180.34,27.94 270 top
R63  182.88,27.94 90 top
R64  185.42,27.94 90 top
R65  193.04,63.5 270 top
R66  195.58,63.5 270 top
R67  201.93,64.77 0 top
R68  198.12,58.42 90 top
R69  200.66,58.42 90 top
R70  203.2,58.42 90 top
R71  212.09,64.77 180 top
R72  193.04,53.34 270 top
R73  173.99,46.99 180 top
R74  190.5,30.48 90 top
R75  193.04,30.48 90 top
R76  198.12,30.48 90 top
R77  200.66,30.48 90 top
R78  203.2,30.48 90 top
R79  193.04,40.64 270 top
R80  195.58,43.18 90 top
R81  198.12,43.18 90 top
R82  217.17,67.31 180 top
R83  215.9,58.42 90 top
R84  218.44,58.42 90 top
R85  214.63,24.13 180 top
R86  215.9,30.48 90 top
R87  218.44,30.48 90 top
R88  215.9,43.18 90 top
R89  218.44,43.18 270 top
R90  220.98,40.64 270 top
R91  179.07,-31.75 90 top  (outside the outline)
R92  107.95,-33.02 90 top  (outside the outline)
R93  111.76,-33.02 90 top  (outside the outline)
R94  115.57,-33.02 90 top  (outside the outline)
R95  129.54,-53.34 90 top  (outside the outline)
R96  182.88,-31.75 90 top  (outside the outline)
R97  134.62,-31.75 90 top  (outside the outline)
R98  138.43,-31.75 90 top  (outside the outline)
R99  142.24,-31.75 90 top  (outside the outline)
R100  186.69,-31.75 90 top  (outside the outline)
R101  133.35,-53.34 90 top  (outside the outline)
R102  137.16,-53.34 90 top  (outside the outline)
R103  140.97,-53.34 90 top  (outside the outline)
R104  69.85,-34.29 90 top  (outside the outline)
R105  81.28,-34.29 90 top  (outside the outline)
R106  85.09,-34.29 90 top  (outside the outline)
R107  88.9,-34.29 90 top  (outside the outline)
R108  92.71,-34.29 90 top  (outside the outline)
R109  109.22,-49.53 90 top  (outside the outline)
R110  113.03,-49.53 90 top  (outside the outline)
R111  116.84,-49.53 90 top  (outside the outline)
R112  73.66,-34.29 90 top  (outside the outline)
T1  72.39,31.75 90 top
T2  100.33,31.75 270 top
T3  110.49,31.75 90 top
T4  138.43,31.75 270 top
T5  165.1,62.23 90 top
T6  184.15,62.23 90 top
T7  220.98,59.69 90 top

### Tracks (layer width: path | path; a pad name or v marks a point on that pad's centre or on a via)
4016_VCF  (via drill 0.6)  (2 unrouted)
  Top 0.406: IC13.5 v154.94,31.75
  Bottom 0.406: IC13.5 IC13.6 | IC13.12 IC13.13 154.94,39.37 v154.94,31.75
4016_VCO  (1 unrouted)
4016_VCO_CV1  (via drill 0.6)
  Top 0.406: 62.23,64.77 60.96,63.5 50.8,63.5 49.53,64.77 44.45,64.77 IC2.13 | IC2.5 35.56,55.88 v44.45,55.88
  Bottom 0.406: IC2.6 IC2.5 | IC2.13 IC2.12 44.45,57.15 v44.45,55.88
ATK_CV
  Top 0.406: IC9.1 C8.2 30.48,39.37 27.94,39.37 26.67,38.1 25.4,38.1 IC8.12
BEND_CV
  Top 0.406: IC9.14 C15.2 47.62,35.56 50.8,35.56 IC10.3
DECAY_CV
  Top 0.406: IC9.2 C9.2 28.57,35.56 17.78,35.56 IC8.3
ENV  (via drill 0.6)  (6 unrouted)
  Top 0.406: 138.43,49.53 140.97,46.99 165.1,46.99 v167.64,49.53 | 160.02,60.96 162.56,58.42 165.1,58.42 166.37,59.69 IC7.2 171.45,58.42 179.07,58.42 180.34,57.15 184.15,57.15 186.69,54.61 187.96,54.61 R54.1
  Bottom 0.406: IC7.1 IC7.2 167.64,57.15 v167.64,49.53 166.37,48.26
FLT_CV
  Top 0.406: IC9.5 C11.2 30.48,30.48 29.21,29.21 26.67,29.21 IC8.10
GND  (via drill 0.6)  (29 unrouted)
  Top 0.406: 118.11,58.42 118.75,59.05 IC6.3 | IC6.5 128.27,57.47 v128.27,57.15 | v128.27,54.61 128.27,52.07 | v161.29,27.94 154.94,27.94 153.67,26.67 IC13.7 | IC14.5 173.99,34.29 172.72,35.56 166.37,35.56 165.1,34.29 162.56,34.29 C25.1 | R81.2 R80.2
  Top 1.27: IC1.7 16.51,46.99 v27.94,46.99 34.29,46.99 | IC2.7 34.29,46.99 | 34.29,46.99 46.99,46.99 IC3.7 IC3.9 63.5,52.07 | 63.5,52.07 R18.1 82.55,52.07 | 82.55,52.07 R20.1 v116.84,52.07 128.27,52.07 v135.89,52.07 R52.1 C20.- R55.2 C22.- C26.1 200.66,52.07 | 82.55,52.07 IC4.4 | C5.1 63.5,52.07 | 215.9,52.07 218.44,52.07 R84.1 | 215.9,52.07 205.74,52.07 | 205.74,52.07 C29.- 200.66,52.07 | R69.1 200.66,52.07 | IC5.4 205.74,52.07 | R83.1 215.9,52.07
  Bottom 0.406: 77.47,49.53 R18.1 | 93.98,38.1 93.98,50.8 R20.1 | C16.2 97.79,34.29 | 115.57,50.8 v116.84,52.07 116.84,55.88 | 133.35,43.18 135.89,45.72 v135.89,52.07 | v128.27,57.15 v128.27,54.61 | 161.29,36.83 161.29,31.75 162.56,30.48 162.56,27.94 v161.29,27.94 | C25.1 161.29,36.83 | 161.29,36.83 161.29,50.8 R52.1 | R72.1 193.04,54.61 C26.1 R80.2 | R84.1 R89.1 R90.1
  Bottom 1.27: v27.94,46.99 C8.1 C9.1 C10.1 27.94,24.13 IC9.8 | C14.1 C12.1 C15.1 C13.1 48.26,49.53 IC3.7
  other vias: 195.58,52.07
N$1
  Bottom 0.406: IC1.4 IC1.5
N$2
  Top 0.406: R1.1 IC1.6
  Bottom 0.406: R1.1 11.43,49.53 11.43,44.45 R5.2
N$3
  Top 0.406: C1.1 IC1.1 17.78,63.5 25.4,63.5 26.67,64.77 IC2.1
N$4
  Top 0.406: C1.2 11.43,63.5 12.7,62.23 IC1.2 20.32,62.23 21.59,60.96 30.48,60.96 33.02,58.42 43.18,58.42 44.45,57.15 49.53,57.15 50.8,58.42 60.96,58.42 R15.1
  Bottom 0.406: R3.1 C1.2
N$5
  Top 0.406: IC1.8 R2.2 27.94,50.8 30.48,50.8 R7.2
N$6
  Top 0.406: R2.1 IC1.11
  Bottom 0.406: R6.2 R2.1
N$7
  Top 0.406: R1.2 IC1.3 | R4.1 R3.2
  Bottom 0.406: R3.2 11.43,57.15 R1.2
N$8
  Top 0.406: R7.1 IC2.4
N$9
  Bottom 0.406: IC1.10 IC1.9
N$10
  Top 0.406: IC1.13 25.4,62.23 26.67,63.5 29.21,63.5 C2.1 33.02,59.69 IC2.3
N$11
  Top 0.406: R4.2 10.16,60.96 19.05,60.96 20.32,59.69 IC1.12
  Bottom 0.406: IC1.12 26.48,61.25 | 26.48,61.25 C2.2 | R6.1 26.48,61.25
N$12
  Top 0.406: C3.2 IC3.2 55.88,62.23 57.15,60.96 62.23,60.96 C4.+
  Bottom 0.406: R9.1 C3.2
N$13
  Bottom 0.406: IC3.1 49.53,64.77 C3.1 R8.1
N$14
  Top 0.406: C28.1 R53.2
  Bottom 0.406: IC14.6 180.36,36.83 Q3.2 184.17,43.16 C28.1
N$15
  Top 0.406: R10.1 IC3.3
  Bottom 0.406: R10.1 46.99,57.15 R9.2
N$16  (via drill 0.6)
  Top 0.406: R5.1 15.24,50.8 v19.05,50.8 | v19.05,58.42 25.4,58.42 26.67,59.69 v30.48,59.69
  Bottom 0.406: v19.05,50.8 v19.05,58.42 | v30.48,59.69 33.02,62.23 IC2.2
N$17
  Top 0.406: IC3.6 R10.2 46.99,49.53 IC2.8
N$18
  Bottom 0.406: IC3.4 IC3.5
N$19
  Top 0.406: R8.2 IC2.9
N$20
  Top 0.406: C4.- 66.04,60.96 R12.1
N$21
  Bottom 0.406: IC3.12 IC3.11
N$22
  Top 0.406: R12.2 R13.1
  Bottom 0.406: C5.2 69.85,53.34 69.85,57.15 R13.1
N$23
  Bottom 0.406: R14.1 67.31,53.34 64.77,50.8 64.77,46.99 62.23,44.45 62.23,29.21 IC10.9 IC10.8
N$24
  Top 0.406: IC10.7 53.34,25.4 60.96,25.4 R28.2
  Bottom 0.406: IC10.6 IC10.7
N$25  (via drill 0.6)
  Top 0.406: v52.07,45.72 69.85,45.72 71.12,46.99 97.79,46.99 99.06,45.72 102.87,45.72 104.14,46.99 R43.2
  Bottom 0.406: IC10.2 IC10.1 v52.07,45.72
N$26
  Top 0.406: IC10.14 R26.2
  Bottom 0.406: IC10.14 IC10.13
N$27
  Top 0.406: IC12.9 R45.2 C21.1
N$28
  Top 0.406: R18.2 R16.1
  Bottom 0.406: R16.1 R14.2 | R18.2 IC4.3
N$29
  Top 0.406: IC8.1 16.51,45.72 49.53,45.72 50.8,46.99 69.85,46.99 71.12,48.26 97.79,48.26 99.06,46.99 102.87,46.99 104.14,48.26 128.27,48.26 129.54,46.99 R46.1
  Bottom 0.406: IC8.1 IC8.2
N$30
  Top 0.406: R42.2 142.24,43.18 134.62,43.18 133.35,44.45 128.27,44.45 127,45.72 110.49,45.72 107.95,43.18 97.79,43.18 96.52,44.45 72.39,44.45 71.12,43.18 25.4,43.18 IC8.14
  Bottom 0.406: IC8.14 IC8.13
N$31  (via drill 0.6)
  Top 0.406: IC8.8 30.48,26.67 31.75,27.94 v57.15,27.94 | v57.15,54.61 58.42,55.88 60.96,55.88 R11.1
  Bottom 0.406: v57.15,27.94 v57.15,54.61 | IC8.9 IC8.8
N$32  (via drill 0.6)
  Top 0.406: v19.05,43.18 20.32,44.45 69.85,44.45 71.12,45.72 97.16,45.72 98.42,44.45 107.31,44.45 109.86,46.99 127,46.99 128.27,45.72 134.62,45.72 135.89,44.45 137.16,44.45 138.43,45.72 166.37,45.72 170.18,49.53 R57.1
  Bottom 0.406: IC8.7 IC8.6 19.05,31.75 v19.05,43.18
N$33  (via drill 0.6)
  Top 0.406: R11.2 63.5,63.5 78.74,63.5 81.28,60.96 92.71,60.96 93.98,62.23 v97.79,62.23
  Bottom 0.406: IC4.5 97.79,54.61 R22.2 97.79,59.69 | v97.79,62.23 97.79,59.69 | 97.79,59.69 R20.2 | R21.1 97.79,59.69
N$34  (via drill 0.6)
  Top 0.406: R23.2 102.87,59.69 111.76,59.69 114.28,62.21 Q1.2 114.3,62.21 114.3,60.96 119.38,60.96 120.02,60.33 IC6.2 123.83,60.33 124.46,59.69 124.46,58.42 | C17.1 124.46,54.61 124.46,58.42 | 124.46,58.42 v125.09,58.42 | v125.09,62.87 127,64.77 152.4,64.77 v157.48,59.69
  Bottom 0.406: v125.09,58.42 v125.09,62.87 | v157.48,59.69 R51.1
N$35
  Top 0.406: R58.1 158.75,33.02 151.13,33.02 IC13.4
N$36  (via drill 0.6)  (1 unrouted)
  Top 0.406: R19.1 v104.14,64.77 | v104.14,54.61 92.71,54.61 IC4.6
  Bottom 0.406: 104.14,72.39 v104.14,64.77 v104.14,54.61 104.14,-6.35
N$37
  Top 0.406: IC4.2 86.36,59.69 87.63,58.42 91.44,58.42 R19.2 95.25,57.15 100.33,62.23 101.6,62.23 102.87,60.96 110.49,60.96 111.76,62.23 Q1.4
N$38
  Top 0.406: R15.2 C7.+
N$40  (via drill 0.6)  (1 unrouted)
  Top 0.406: C7.- 78.74,55.88 83.19,55.88 v84.45,54.61
  Bottom 0.406: v84.45,54.61 84.45,38.73 IC11.3
N$42
  Bottom 0.406: T1.3 69.85,34.29 R24.2
N$43  (1 unrouted)
  Top 0.406: R28.1 69.85,26.71 69.89,26.67 72.39,26.67 T1.1
N$44  (via drill 0.6)  (2 unrouted)
  Bottom 0.406: v72.39,34.29 R30.2
N$45
  Top 0.406: Q1.3 114.3,63.5 120.65,63.5 122.56,61.59 IC6.1
N$46  (via drill 0.6)
  Top 0.406: v74.93,41.91 76.2,43.18 81.28,43.18 IC11.1
  Bottom 0.406: v74.93,41.91 74.93,34.29 73.66,33.02 72.41,33.02 T1.4
N$47  (via drill 0.6)
  Top 0.406: v95.25,24.13 104.14,24.13 105.41,25.4 109.22,25.4 110.49,24.13 118.11,24.13 118.11,26.67 | 118.11,26.67 IC12.7 | IC12.5 118.11,29.21 118.11,26.67
  Bottom 0.406: IC11.12 R33.1 92.71,26.67 v95.25,24.13 97.79,26.67 C16.1
N$48  (1 unrouted)
N$49  (1 unrouted)
  Top 0.406: R25.1 15.24,27.94 29.21,27.94 30.48,29.21 IC9.6
  Bottom 0.406: R25.1 13.97,24.13 7.62,17.78 7.62,-2.54
N$50  (via drill 0.6)  (1 unrouted)
  Top 0.406: IC9.9 v37.47,24.13
  Bottom 0.406: 37.47,72.39 v37.47,24.13 37.47,-5.08
N$51  (via drill 0.6)  (1 unrouted)
  Top 0.406: IC9.10 v38.73,26.67
  Bottom 0.406: 38.73,72.39 v38.73,26.67 38.73,-6.35
N$52  (1 unrouted)
  Bottom 0.406: IC9.11 40.01,29.21 | 40.01,29.21 40.01,73.66 | 40.01,29.21 40.01,-8.89
N$53  (1 unrouted)
  Bottom 0.406: IC9.3 36.2,36.83 | 36.2,36.83 36.2,71.75 | 36.2,36.83 36.2,-1.91
N$54  (1 unrouted)
N$56  (1 unrouted)
  Bottom 0.406: T2.1 R32.1
N$57  (2 unrouted)
  Top 0.406: R26.1 64.77,29.21 68.58,25.4 91.44,25.4 92.71,26.67 | 96.48,26.67 100.29,29.21 | 100.29,29.21 106.68,29.21 107.99,29.25 T3.1 | 100.29,29.21 T2.5
N$58
  Bottom 0.406: R31.1 102.87,39.37 102.87,31.75 T2.3
N$59  (via drill 0.6)  (1 unrouted)
  Top 0.406: IC11.16 91.44,43.18 95.25,43.18 v96.52,41.91
  Bottom 0.406: v96.52,41.91 96.52,39.37 99.06,36.83 99.06,33.02 100.31,33.02
N$60  (2 unrouted)
  Bottom 0.406: R34.1 113.03,24.13 113.03,27.94
N$61  (via drill 0.6)
  Top 0.406: v113.03,41.91 115.57,41.91 116.84,43.18 119.38,43.18 IC12.1
  Bottom 0.406: v113.03,41.91 113.03,31.75 111.76,30.48 110.51,30.48 T3.2
N$62  (1 unrouted)
  Top 0.406: T3.5 110.53,34.29
  Bottom 0.406: T3.5 R36.1
N$63
  Bottom 0.406: R35.1 107.95,39.37 107.95,33.02 109.22,31.75 T3.3
N$64  (2 unrouted)
  Top 0.406: 133.39,34.25 T4.1
  Bottom 0.406: R39.1 138.43,34.29
N$65  (via drill 0.6)
  Top 0.406: IC12.8 121.92,25.4 144.78,25.4 R44.2 v165.1,24.13 | v165.1,26.67 166.37,27.94 181.61,27.94 R64.2
  Bottom 0.406: v165.1,24.13 v165.1,26.67
N$67  (1 unrouted)
N$68
  Bottom 0.406: IC13.9 R56.2
N$69
  Top 0.406: R38.1 R41.2
  Bottom 0.406: T4.3 139.7,31.75 140.97,34.29 R41.2
N$70  (via drill 0.6)
  Top 0.406: v135.89,41.91 133.35,41.91 132.08,43.18 129.54,43.18 IC12.16
  Bottom 0.406: v135.89,41.91 135.89,34.29 137.18,33 T4.2
N$71  (2 unrouted)
N$72  (1 unrouted)
N$73  (via drill 0.6)  (2 unrouted)
  Top 0.406: 137.2,29.25 137.24,29.21 v138.43,29.21
  Bottom 0.406: R42.1 142.88,33.66 142.88,31.11 141.01,29.25 138.47,29.25 v138.43,29.21
N$74
  Bottom 0.406: IC12.10 R40.1 IC12.12
N$75  (2 unrouted)
  Bottom 0.406: Q1.5 107.95,62.23
N$76  (1 unrouted)
N$77  (2 unrouted)
  Bottom 0.406: 135.89,59.69 Q2.5
N$78  (via drill 0.6)  (1 unrouted)
  Top 0.406: v115.57,62.19 115.61,62.23 120.65,62.23 120.65,60.96 124.46,60.96 125.73,59.69 R48.1
  Bottom 0.406: Q1.1 v115.57,62.19
N$79
  Top 0.406: IC6.6 128.91,59.05 129.54,58.42 130.81,58.42 R47.1 C18.2
  Bottom 0.406: C18.2 139.72,57.17 Q2.4
N$80  (1 unrouted)
N$81  (1 unrouted)
  Top 0.406: R49.2 Q2.1
  Bottom 0.406: Q2.1 143.51,59.65
N$82
  Top 0.406: IC6.7 129.54,60.33 131.44,62.23 138.43,62.23 Q2.3
N$83
  Top 0.406: C24.1 160.02,39.37 158.75,38.1 151.13,38.1 IC13.3
  Bottom 0.406: IC13.2 IC13.3
N$84  (2 unrouted)
N$85  (via drill 0.6)
  Top 0.406: v146.05,35.56 154.94,35.56 156.21,34.29 IC13.11 | C23.2 160.02,29.21 158.75,30.48 147.32,30.48 C21.2
  Bottom 0.406: C21.2 143.51,29.21 144.15,29.84 144.15,33.02 146.05,34.92 v146.05,35.56
N$86
  Top 0.406: C19.- R51.2 R52.2
N$87  (1 unrouted)
  Top 0.406: Q2.2 144.76,62.23 146.05,62.23 151.13,57.15 161.29,57.15 C20.+ 166.37,57.15 IC7.3
  Bottom 0.406: 163.83,58.42 C20.+
N$92  (via drill 0.6)
  Top 0.406: R41.1 v165.1,49.53 | v161.29,54.61 162.56,53.34 165.1,53.34 167.64,55.88 176.53,55.88 IC7.6
  Bottom 0.406: v165.1,49.53 163.83,49.53 161.29,52.07 v161.29,54.61 | IC7.6 IC7.7
N$93
  Top 0.406: R56.1 IC15.3
  Bottom 0.406: R56.1 166.37,26.67 C23.1
N$94  (2 unrouted)
  Top 0.406: IC7.5 C22.+
N$95
  Top 0.406: R59.1 158.75,40.64 151.13,40.64 IC13.1
N$96
  Top 0.406: IC14.3 C25.2
  Bottom 0.406: C25.2 163.83,38.1 166.37,38.1 166.37,40.64 R59.2
N$97
  Top 0.406: IC14.2 171.45,39.37 175.26,35.56 179.07,35.56 R61.1
  Bottom 0.406: C24.2 IC14.2 IC14.1
N$98
  Top 0.406: R60.1 IC15.1 171.45,30.48 181.61,30.48 R63.2
  Bottom 0.406: IC15.1 IC15.2
N$99
  Top 0.406: R58.2 168.91,33.02 179.07,33.02 R62.1
  Bottom 0.406: R62.1 IC15.7
N$100
  Top 0.406: C27.+ 185.42,25.4 181.61,25.4 R62.2
  Bottom 0.406: R62.2 IC15.6
N$101
  Top 0.406: R66.2 203.2,59.69 IC5.1
  Bottom 0.406: R66.2 194.31,60.96 190.5,60.96 D1.C
N$102  (via drill 0.6)  (1 unrouted)
  Top 0.406: R77.2 198.12,31.75 189.23,31.75 184.15,26.67 180.34,26.67 IC15.5 176.53,25.4 158.75,25.4 IC13.8
  Bottom 1.27: 152.4,26.67 152.4,-3.81 | 152.4,76.2 152.4,26.67 | 152.4,26.67 IC13.8
  other vias: 157.48,26.67
N$103
  Top 0.406: R68.2 195.58,62.23 R65.2 195.58,57.15 196.85,57.15 198.12,58.42 212.09,58.42 IC5.7
N$104
  Bottom 0.406: R69.2 201.93,58.42 | 201.93,58.42 R70.1 | IC5.2 201.93,58.42
N$105  (1 unrouted)
  Bottom 0.406: R85.1 R87.1
  Bottom 1.27: R87.1 223.52,26.67 | 223.52,26.67 223.52,73.66 | 223.52,26.67 223.52,-5.08
N$106
  Top 0.406: R54.2 R72.2
N$107
  Top 0.406: C26.2 198.12,57.15 | 198.12,57.15 IC5.3 | R68.1 198.12,57.15
N$108
  Top 0.406: R63.1 R64.1 186.69,25.4 C27.-
N$110  (1 unrouted)
N$111  (via drill 0.6)
  Top 0.406: Q3.4 186.67,40.66 186.69,40.64 191.77,40.64 v195.58,36.83
  Bottom 0.406: v195.58,36.83 Q4.3
N$113
  Bottom 0.406: Q4.1 190.54,26.67 R74.1 190.5,27.94 187.96,30.48 R61.2
N$114
  Top 0.406: R81.1 199.39,40.64 203.2,40.64 204.47,41.91 IC16.3
  Bottom 0.406: IC16.3 Q6.3 203.2,48.26 C29.+
N$115
  Top 0.406: R76.1 198.12,29.21 IC17.3 R85.2
  Bottom 0.406: R76.1 196.85,24.15 Q4.4
N$116
  Bottom 0.406: R77.1 199.39,25.44 Q4.5
N$117
  Top 0.406: R75.1 196.85,30.48 204.47,30.48 IC17.2
  Bottom 0.406: R78.1 203.2,29.21 IC17.2 | R75.1 194.33,26.65 Q4.2
N$118  (1 unrouted)
  Top 0.406: 190.5,36.83 R75.2 R76.2
N$119
  Top 0.406: R78.2 IC17.1 IC17.5
N$120
  Top 0.406: R79.1 196.9,43.35 | 196.9,43.35 Q6.1 | R80.1 196.9,43.35
  Bottom 0.406: C32.+ 200.66,40.64 Q6.1
N$121
  Top 0.406: IC16.6 R88.1 R89.2
N$122  (via drill 0.6)  (3 unrouted)
  Top 0.406: R71.2 R67.2
  Bottom 0.406: v208.28,49.53 R71.2
N$123  (2 unrouted)
  Top 0.406: R71.1 218.44,64.77
N$124  (1 unrouted)
  Bottom 0.406: IC5.6 215.9,59.69 R83.2
N$125
  Bottom 0.406: R84.2 218.44,59.69 IC5.5 C30.2
N$126
  Top 0.406: C32.- 203.2,39.37 204.47,40.64 209.55,40.64 IC16.7
  Bottom 0.406: R88.2 IC16.7
N$127
  Top 0.406: IC14.7 184.15,39.37 Q3.3
N$128  (2 unrouted)
  Bottom 0.406: Q3.5 187.92,46.95
N$130
  Top 0.406: IC16.5 215.9,36.83 R90.2 PAD8.1
N$134
  Top 0.406: R86.1 IC17.6 C31.2
  Bottom 0.406: C31.2 R87.2
N$136
  Top 0.406: IC17.7 215.9,31.75 | 215.9,31.75 218.44,31.75 C31.1 PAD10.1 | R86.2 215.9,31.75
NOISE  (via drill 0.6)  (2 unrouted)
  Top 0.406: v106.68,41.91 107.95,41.91 110.49,44.45
  Bottom 0.406: R34.2 106.68,31.75 | 106.68,31.75 106.68,-5.08 | 106.68,31.75 v106.68,41.91 106.68,74.93
NOISE_CV
  Top 0.406: IC9.15 C13.2 46.99,39.37 49.53,39.37 50.8,38.1 55.88,38.1 IC10.12
OVR-T_CV
  Top 0.406: IC9.12 C14.2 46.99,29.21 IC10.5
PITCH_CV
  Top 0.406: IC9.13 C12.2 46.99,33.02 49.53,33.02 49.53,30.48 58.42,30.48 IC10.10
TRIG  (2 unrouted)
  Top 0.406: D1.A R67.1
VCO_OUT  (via drill 0.6)  (2 unrouted)
  Top 0.406: R13.2 76.2,58.42 v85.72,58.42
  Bottom 0.406: v85.72,58.42 85.72,34.92 IC11.5
VDD  (via drill 0.6)  (1 unrouted)
  Top 0.406: v21.59,34.29 IC8.4 R25.2 | v55.88,41.91 IC9.16 | v175.26,46.99 R73.2 167.64,44.45 160.02,44.45 IC13.14 | R30.1 81.28,38.1 v87.63,38.1 91.44,38.1 R32.2 | R36.2 119.38,38.1 v126.36,38.1 129.54,38.1 R39.2 | IC6.8 127.64,61.59 v127,62.23 | T6.C IC7.8 | R70.2 203.2,67.31 | v210.82,36.83 198.12,36.83 196.85,35.56 194.31,35.56 R79.2 190.5,39.37 185.42,39.37
  Top 1.27: IC1.14 24.13,67.31 41.91,67.31 | IC2.14 41.91,67.31 | 41.91,67.31 59.69,67.31 | IC3.14 59.69,67.31 | 59.69,67.31 R16.2 v87.63,67.31 R21.2 v126.36,67.31 R48.2 R49.1 R50.2 v162.56,67.31 v175.26,67.31 R65.1 R66.1 203.2,67.31 v210.82,67.31 R82.2
  Bottom 0.406: IC3.13 IC3.14 | R32.2 R31.2 | R35.2 R36.2 | v127,62.23 126.36,62.23 | v162.56,67.31 162.56,64.77 T5.C | R39.2 R38.2 | Q6.2 195.58,44.45 193.04,41.91 R79.2
  Bottom 1.27: 87.63,62.23 87.63,64.77 | IC3.14 55.88,64.77 v55.88,41.91 55.88,31.75 IC10.4 | IC1.14 21.59,64.77 v21.59,34.29 | R17.2 87.63,64.77 | IC4.8 87.63,62.23 | 87.63,64.77 v87.63,67.31 | IC11.11 87.63,29.21 v87.63,38.1 87.63,62.23 | IC12.11 126.36,29.21 v126.36,38.1 126.36,62.23 v126.36,67.31 | 175.26,62.23 v175.26,67.31 175.26,73.66 | 175.26,62.23 v175.26,46.99 175.26,41.91 | 175.26,41.91 175.26,31.75 | 175.26,31.75 175.26,-2.54 | IC14.8 175.26,41.91 | IC15.8 175.26,31.75 | IC7.8 175.26,62.23 | 210.82,62.23 210.82,46.99 | 210.82,46.99 v210.82,36.83 210.82,34.29 IC17.8 | IC5.8 210.82,62.23 | 210.82,62.23 v210.82,67.31 | 210.82,46.99 IC16.8
VOL_CV
  Top 0.406: IC9.4 C10.2 29.21,33.02 17.78,33.02 IC8.5
VSS  (via drill 0.6)
  Top 0.406: IC9.7 31.75,24.13 31.75,21.59 | IC10.11 64.77,26.67 64.77,21.59 | IC6.4 123.19,57.47 123.19,55.88 v120.65,55.88 | R44.1 R45.1 | T2.4 104.16,30.5 106.66,33 T3.4
  Top 1.27: C6.- 31.75,21.59 64.77,21.59 v74.93,21.59 v80.01,21.59 v98.42,21.59 v122.56,21.59 v138.43,21.59 v172.72,21.59 v208.28,21.59
  Bottom 0.406: IC8.11 21.59,31.75 21.59,24.13 C6.- | v74.93,21.59 74.93,29.21 73.64,30.5 T1.2 | v80.01,21.59 80.01,26.67 IC11.6 | v98.42,21.59 98.42,27.94 99.08,30.5 T2.4 | v138.43,21.59 135.89,24.13 135.89,29.21 137.16,30.48 138.41,30.48 T4.4 139.7,30.48 R45.1
  Bottom 1.27: v122.56,21.59 122.56,29.21 | v120.65,55.88 120.65,45.09 122.56,43.18 122.56,29.21 | 122.56,29.21 IC12.6 | 172.72,54.61 172.72,73.66 | IC7.4 172.72,54.61 | 172.72,54.61 172.72,34.29 | 172.72,24.13 v172.72,21.59 | v208.28,21.59 208.28,26.67 | IC17.4 208.28,26.67 | 208.28,26.67 208.28,39.37 IC16.4 | IC15.4 172.72,24.13 | 172.72,24.13 172.72,34.29 | 172.72,34.29 IC14.4

### Text on the board
tPlace: Filter | Noise